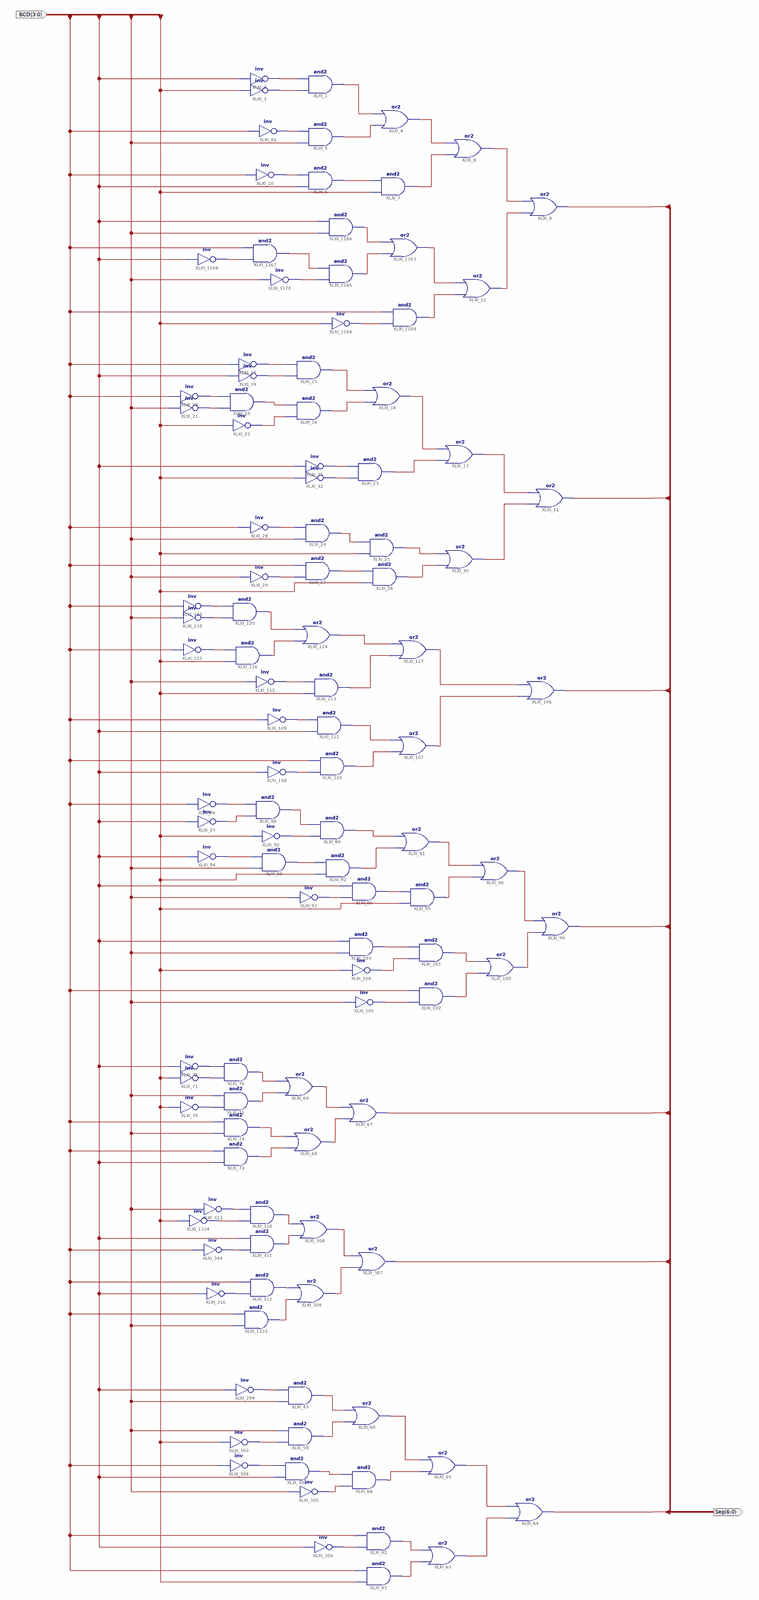
[diagram p0: schematic sheet 1, whole]
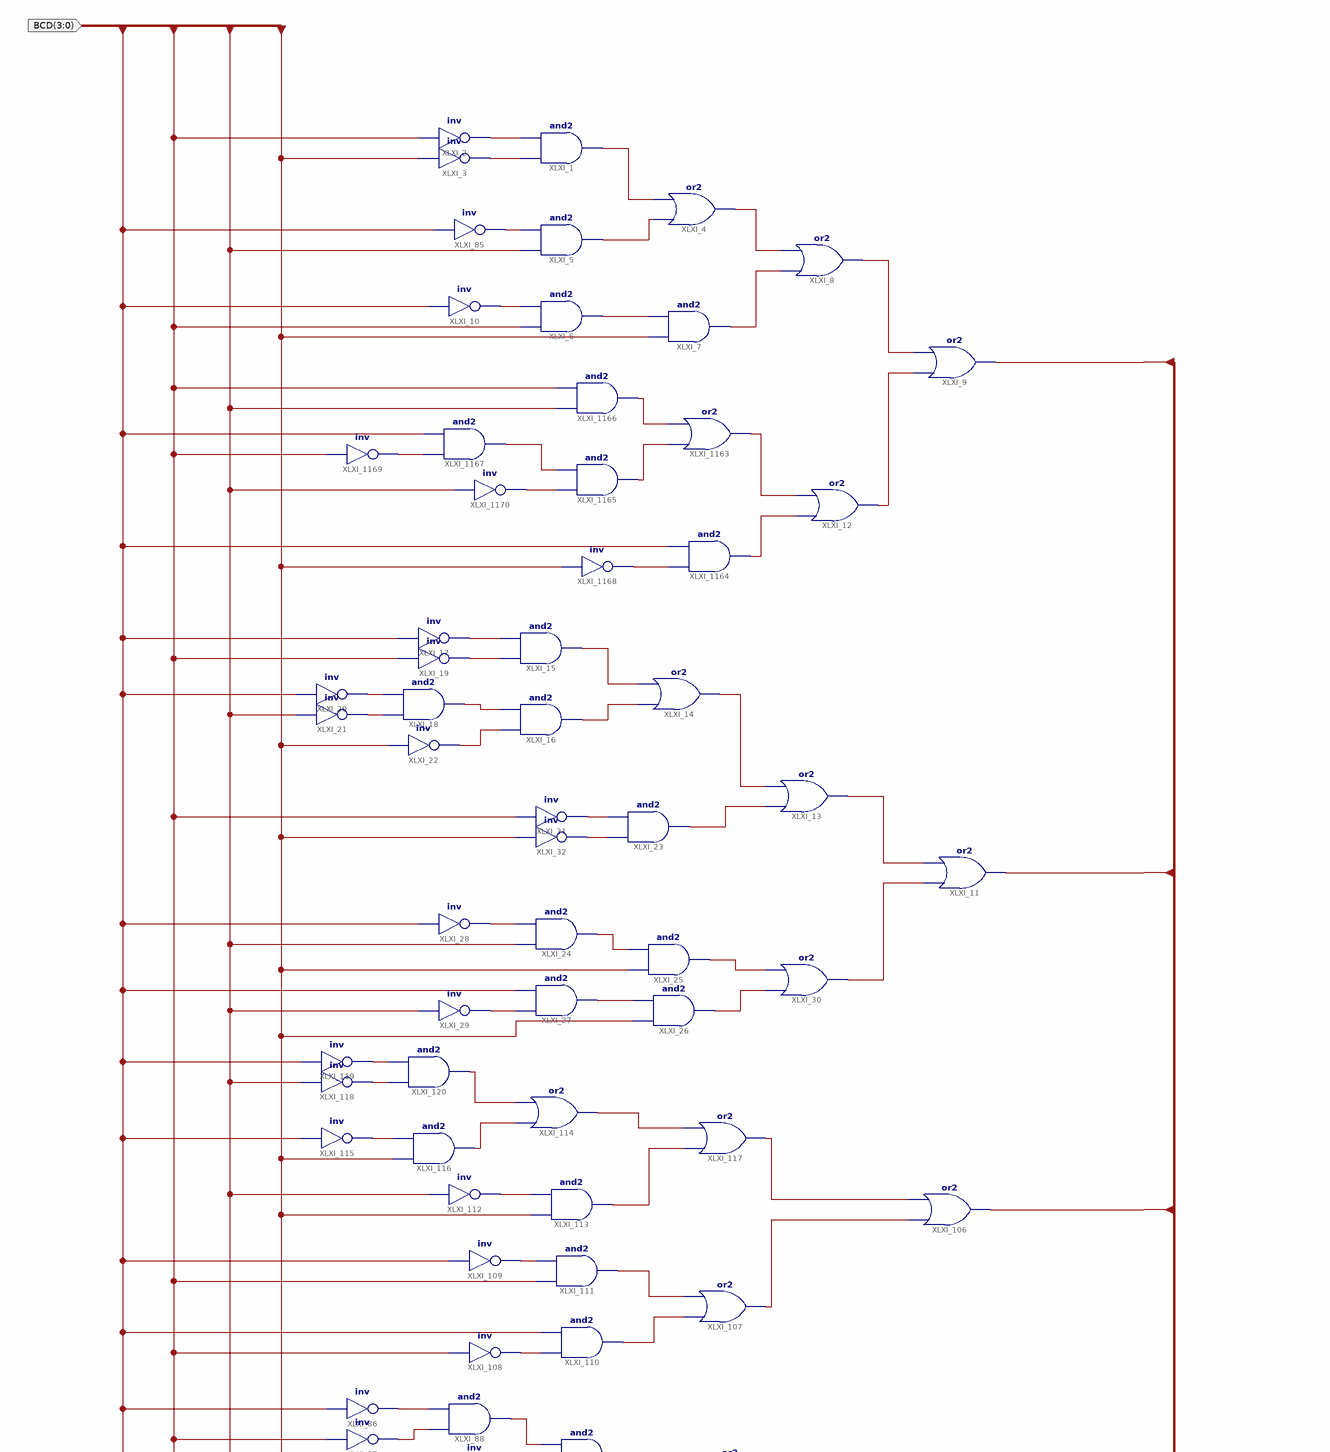
[diagram p1: schematic sheet 1, upper part]
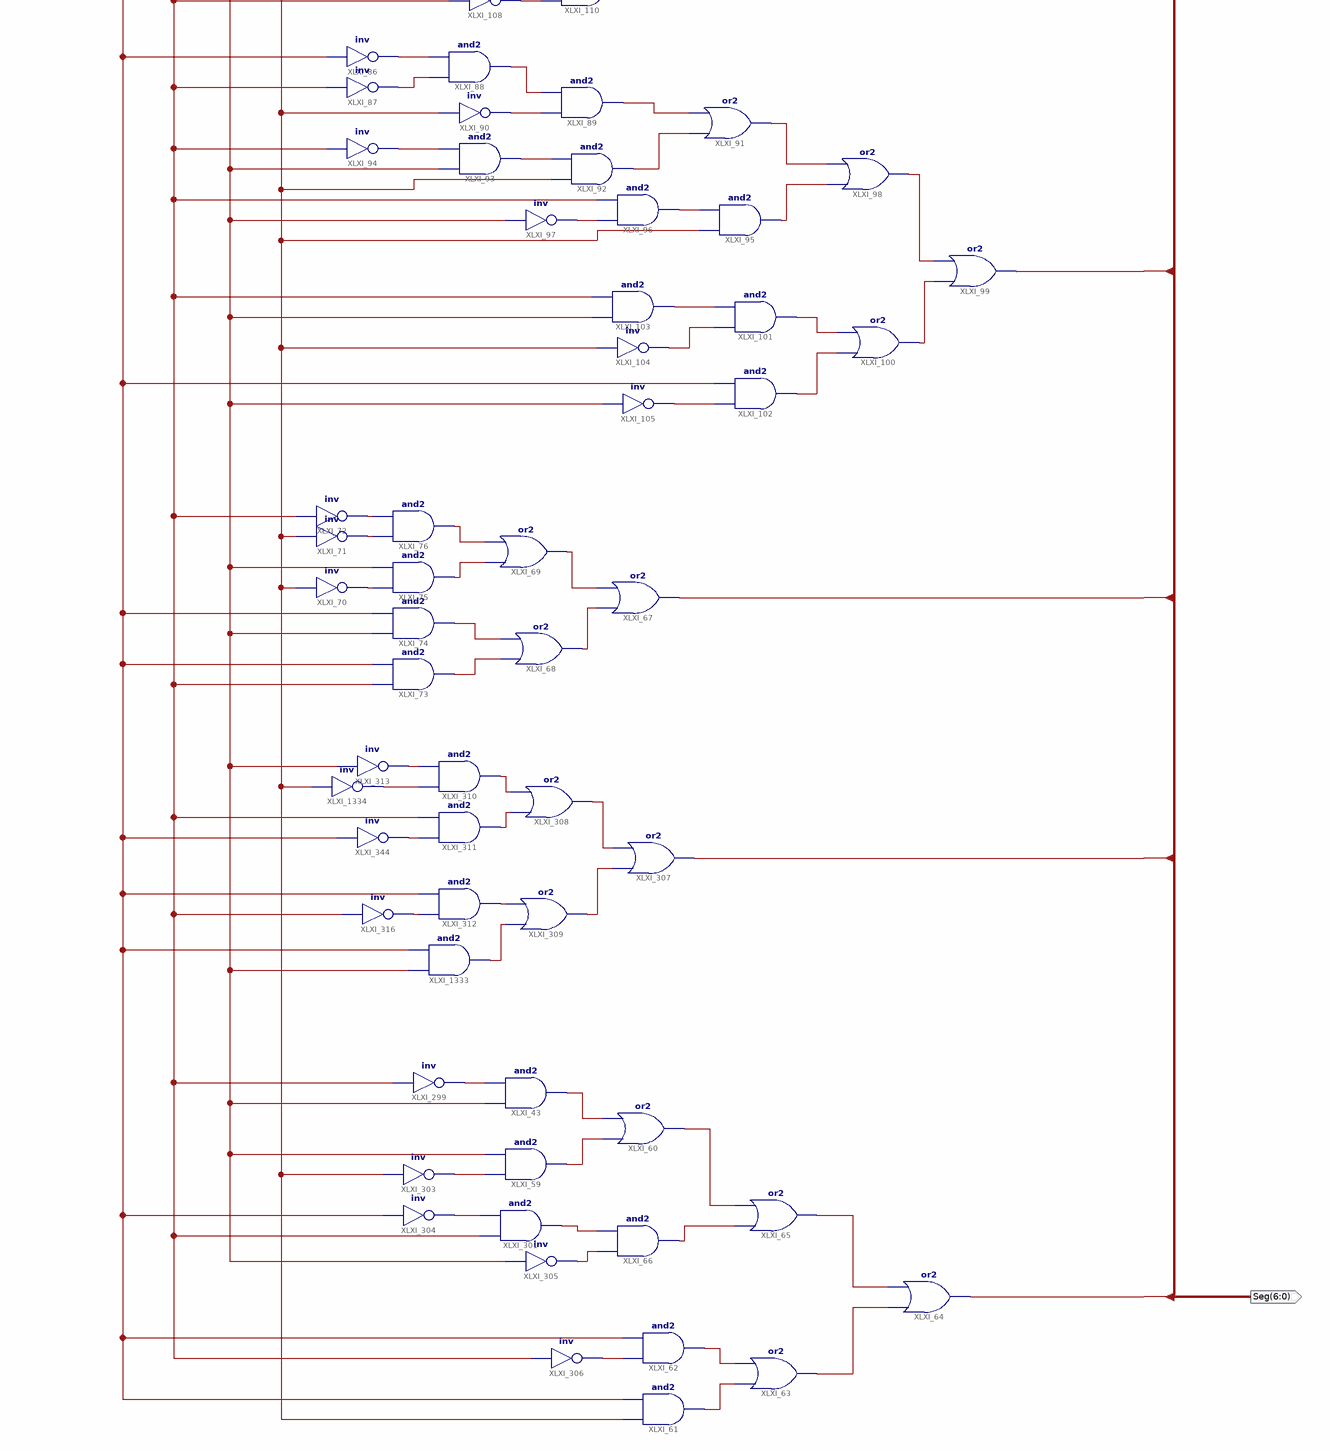
[diagram p2: schematic sheet 1, lower part]
// Xilinx ISE schematic BCDto7Seg.sch (spartan6) as structural Verilog: 112 symbols, 2 ports
module BCDto7Seg (
  input  [3:0] BCD,
  output [6:0] Seg
);

  wire XLXN_1, XLXN_2, XLXN_3, XLXN_5, XLXN_6, XLXN_7, XLXN_8, XLXN_9, XLXN_10, XLXN_12, XLXN_13, XLXN_14,
       XLXN_15, XLXN_16, XLXN_17, XLXN_18, XLXN_19, XLXN_20, XLXN_21, XLXN_23, XLXN_24, XLXN_25, XLXN_26,
       XLXN_27, XLXN_28, XLXN_29, XLXN_30, XLXN_31, XLXN_33, XLXN_34, XLXN_35, XLXN_36, XLXN_38, XLXN_39,
       XLXN_40, XLXN_41, XLXN_53, XLXN_54, XLXN_55, XLXN_56, XLXN_57, XLXN_58, XLXN_59, XLXN_60, XLXN_61,
       XLXN_62, XLXN_63, XLXN_65, XLXN_66, XLXN_67, XLXN_68, XLXN_69, XLXN_70, XLXN_71, XLXN_72, XLXN_76,
       XLXN_77, XLXN_78, XLXN_79, XLXN_80, XLXN_81, XLXN_82, XLXN_83, XLXN_84, XLXN_86, XLXN_87, XLXN_88,
       XLXN_89, XLXN_90, XLXN_92, XLXN_93, XLXN_95, XLXN_96, XLXN_97, XLXN_98, XLXN_99, XLXN_100, XLXN_101,
       XLXN_102, XLXN_103, XLXN_104, XLXN_106, XLXN_107, XLXN_110, XLXN_111, XLXN_113, XLXN_114, XLXN_115,
       XLXN_116, XLXN_117, XLXN_120, XLXN_407, XLXN_427, XLXN_1225, XLXN_1228, XLXN_1231, XLXN_1233,
       XLXN_1234, XLXN_1235, XLXN_1240, XLXN_1241, XLXN_1242, XLXN_1519, XLXN_1520, XLXN_1537;

  not XLXI_299 (XLXN_1537, BCD[2]);
  not XLXI_303 (XLXN_1, BCD[0]);
  and XLXI_43 (XLXN_25, BCD[1], XLXN_1537);
  not XLXI_304 (XLXN_29, BCD[3]);
  not XLXI_1334 (XLXN_1520, BCD[0]);
  and XLXI_1333 (XLXN_1519, BCD[1], BCD[3]);
  and XLXI_312 (XLXN_6, XLXN_9, BCD[3]);
  not XLXI_344 (XLXN_7, BCD[3]);
  and XLXI_310 (XLXN_10, XLXN_1520, XLXN_8);
  and XLXI_311 (XLXN_12, XLXN_7, BCD[2]);
  or XLXI_309 (XLXN_14, XLXN_1519, XLXN_6);
  or XLXI_308 (XLXN_13, XLXN_12, XLXN_10);
  or XLXI_307 (Seg[5], XLXN_14, XLXN_13);
  not XLXI_316 (XLXN_9, BCD[2]);
  not XLXI_313 (XLXN_8, BCD[1]);
  not XLXI_306 (XLXN_17, BCD[2]);
  not XLXI_305 (XLXN_28, BCD[1]);
  and XLXI_301 (XLXN_27, BCD[2], XLXN_29);
  and XLXI_59 (XLXN_26, XLXN_1, BCD[1]);
  or XLXI_60 (XLXN_24, XLXN_26, XLXN_25);
  and XLXI_61 (XLXN_19, BCD[0], BCD[3]);
  and XLXI_62 (XLXN_20, XLXN_17, BCD[3]);
  or XLXI_63 (XLXN_18, XLXN_19, XLXN_20);
  or XLXI_64 (Seg[6], XLXN_18, XLXN_21);
  or XLXI_65 (XLXN_21, XLXN_23, XLXN_24);
  and XLXI_66 (XLXN_23, XLXN_28, XLXN_27);
  or XLXI_67 (Seg[4], XLXN_33, XLXN_34);
  or XLXI_68 (XLXN_33, XLXN_35, XLXN_36);
  or XLXI_69 (XLXN_34, XLXN_38, XLXN_39);
  not XLXI_70 (XLXN_40, BCD[0]);
  not XLXI_71 (XLXN_41, BCD[0]);
  not XLXI_72 (XLXN_31, BCD[2]);
  and XLXI_73 (XLXN_35, BCD[2], BCD[3]);
  and XLXI_74 (XLXN_36, BCD[1], BCD[3]);
  and XLXI_75 (XLXN_38, XLXN_40, BCD[1]);
  and XLXI_76 (XLXN_39, XLXN_41, XLXN_31);
  not XLXI_1170 (XLXN_1241, BCD[1]);
  not XLXI_1169 (XLXN_1242, BCD[2]);
  not XLXI_1168 (XLXN_1235, BCD[0]);
  and XLXI_1167 (XLXN_1240, XLXN_1242, BCD[3]);
  and XLXI_1166 (XLXN_1233, BCD[1], BCD[2]);
  and XLXI_1165 (XLXN_1234, XLXN_1241, XLXN_1240);
  and XLXI_1164 (XLXN_1231, XLXN_1235, BCD[3]);
  or XLXI_1163 (XLXN_1228, XLXN_1234, XLXN_1233);
  not XLXI_85 (XLXN_1225, BCD[3]);
  not XLXI_86 (XLXN_53, BCD[3]);
  not XLXI_87 (XLXN_54, BCD[2]);
  and XLXI_88 (XLXN_55, XLXN_54, XLXN_53);
  and XLXI_89 (XLXN_60, XLXN_56, XLXN_55);
  not XLXI_90 (XLXN_56, BCD[0]);
  or XLXI_91 (XLXN_63, XLXN_59, XLXN_60);
  and XLXI_92 (XLXN_59, BCD[0], XLXN_58);
  and XLXI_93 (XLXN_58, BCD[1], XLXN_57);
  not XLXI_94 (XLXN_57, BCD[2]);
  and XLXI_95 (XLXN_65, BCD[0], XLXN_62);
  and XLXI_96 (XLXN_62, XLXN_61, BCD[2]);
  not XLXI_97 (XLXN_61, BCD[1]);
  or XLXI_98 (XLXN_66, XLXN_65, XLXN_63);
  or XLXI_99 (Seg[3], XLXN_72, XLXN_66);
  or XLXI_100 (XLXN_72, XLXN_70, XLXN_69);
  and XLXI_101 (XLXN_69, XLXN_68, XLXN_67);
  and XLXI_102 (XLXN_70, XLXN_71, BCD[3]);
  and XLXI_103 (XLXN_67, BCD[1], BCD[2]);
  not XLXI_104 (XLXN_68, BCD[0]);
  not XLXI_105 (XLXN_71, BCD[1]);
  or XLXI_106 (Seg[2], XLXN_76, XLXN_77);
  or XLXI_107 (XLXN_76, XLXN_78, XLXN_79);
  not XLXI_108 (XLXN_80, BCD[2]);
  not XLXI_109 (XLXN_81, BCD[3]);
  and XLXI_110 (XLXN_78, XLXN_80, BCD[3]);
  and XLXI_111 (XLXN_79, BCD[2], XLXN_81);
  not XLXI_112 (XLXN_82, BCD[1]);
  and XLXI_113 (XLXN_83, BCD[0], XLXN_82);
  or XLXI_114 (XLXN_84, XLXN_86, XLXN_87);
  not XLXI_115 (XLXN_88, BCD[3]);
  and XLXI_116 (XLXN_86, BCD[0], XLXN_88);
  or XLXI_117 (XLXN_77, XLXN_83, XLXN_84);
  not XLXI_118 (XLXN_89, BCD[1]);
  not XLXI_119 (XLXN_90, BCD[3]);
  and XLXI_120 (XLXN_87, XLXN_89, XLXN_90);
  not XLXI_32 (XLXN_92, BCD[0]);
  not XLXI_31 (XLXN_93, BCD[2]);
  or XLXI_30 (XLXN_95, XLXN_96, XLXN_97);
  not XLXI_29 (XLXN_100, BCD[1]);
  not XLXI_28 (XLXN_101, BCD[3]);
  and XLXI_27 (XLXN_98, XLXN_100, BCD[3]);
  and XLXI_26 (XLXN_96, BCD[0], XLXN_98);
  and XLXI_25 (XLXN_97, BCD[0], XLXN_99);
  and XLXI_24 (XLXN_99, BCD[1], XLXN_101);
  and XLXI_23 (XLXN_30, XLXN_92, XLXN_93);
  not XLXI_22 (XLXN_106, BCD[0]);
  not XLXI_21 (XLXN_16, BCD[1]);
  not XLXI_20 (XLXN_15, BCD[3]);
  not XLXI_19 (XLXN_110, BCD[2]);
  and XLXI_18 (XLXN_107, XLXN_16, XLXN_15);
  not XLXI_17 (XLXN_111, BCD[3]);
  and XLXI_16 (XLXN_427, XLXN_106, XLXN_107);
  and XLXI_15 (XLXN_104, XLXN_110, XLXN_111);
  or XLXI_14 (XLXN_103, XLXN_427, XLXN_104);
  or XLXI_13 (XLXN_102, XLXN_30, XLXN_103);
  or XLXI_12 (XLXN_113, XLXN_1231, XLXN_1228);
  or XLXI_11 (Seg[1], XLXN_95, XLXN_102);
  not XLXI_10 (XLXN_407, BCD[3]);
  or XLXI_9 (Seg[0], XLXN_113, XLXN_114);
  or XLXI_8 (XLXN_114, XLXN_116, XLXN_115);
  and XLXI_7 (XLXN_116, BCD[0], XLXN_117);
  and XLXI_6 (XLXN_117, BCD[2], XLXN_407);
  and XLXI_5 (XLXN_2, BCD[1], XLXN_1225);
  or XLXI_4 (XLXN_115, XLXN_2, XLXN_3);
  not XLXI_3 (XLXN_5, BCD[0]);
  not XLXI_2 (XLXN_120, BCD[2]);
  and XLXI_1 (XLXN_3, XLXN_5, XLXN_120);
endmodule
